# Altium schematic sheet pico-fmeter-AS65-2.SchDoc: Title
size 420 x 297 mm; Author: G.Kasprowicz; CompanyName: WUT ISE; DrawnBy: G.Kasprowicz; Organization: WUT ISE; Address1: PW ISE; Address2: Nowowiejska 15/19 00-665 Warsaw; Address3: gkasprow@gmail.com; Revision: 2; SheetNumber: -; SheetTotal: -; ModifiedBy: -; CheckedDate: -; Title2: Title 2; DivGrp: WUT ISE; Designer: G.Kasprowicz; ModifiedDate: -; ProjectName: Sensor Box
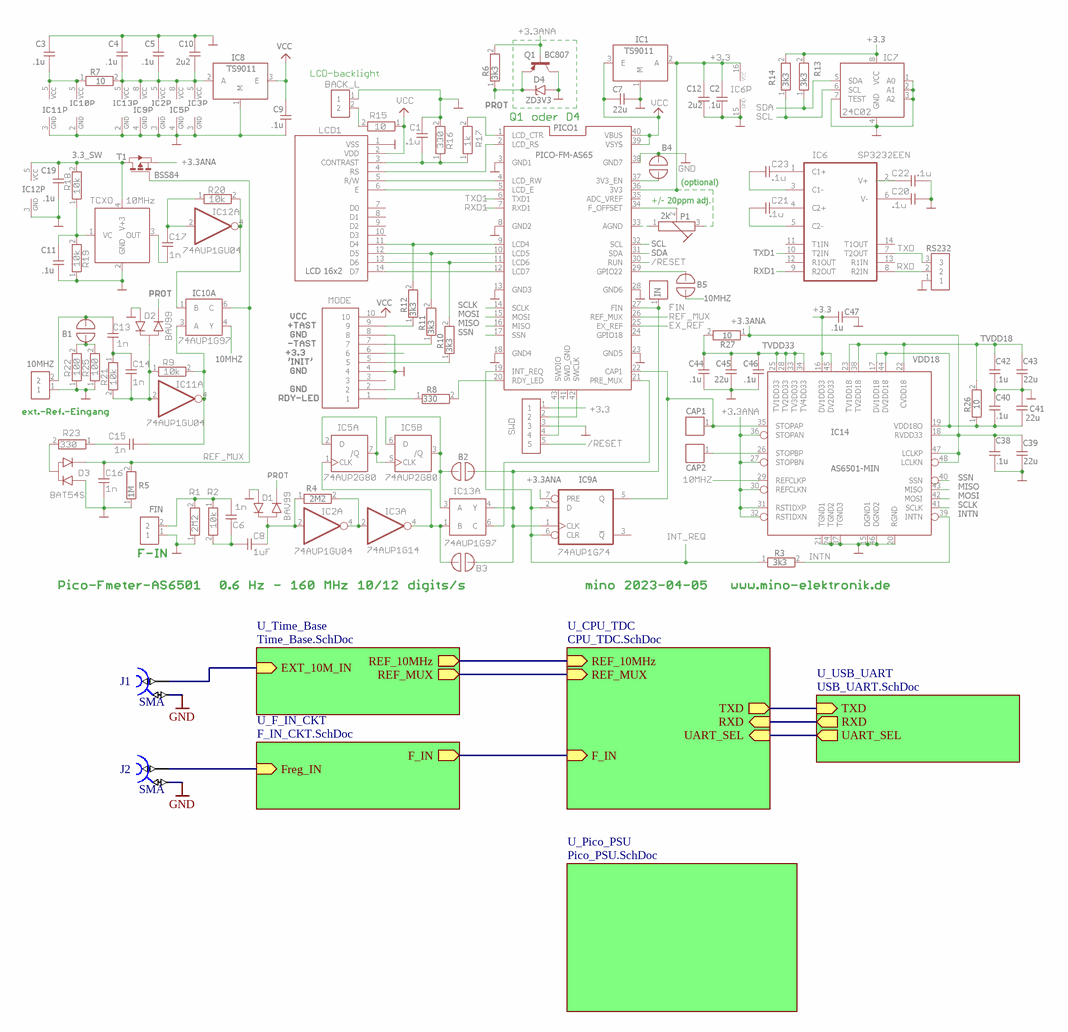
[diagram p0: pico-fmeter-AS65-2.SchDoc]

## Parts
J1  SMA  [JOHNSON_142-0701-871]
J2  SMA  [JOHNSON_142-0701-871]

## Sub-sheets
U_CPU_TDC = CPU_TDC.SchDoc: F_IN (in), REF_MUX (in), REF_10MHz (in), TXD (out), RXD (in), UART_SEL (in)
U_F_IN_CKT = F_IN_CKT.SchDoc: F_IN (out), Freg_IN (in)
U_Pico_PSU = Pico_PSU.SchDoc: no entries
U_Time_Base = Time_Base.SchDoc: REF_10MHz (out), REF_MUX (out), EXT_10M_IN (in)
U_USB_UART = USB_UART.SchDoc: RXD (out), TXD (in), UART_SEL (out)

## Nets
GND: J1.2 J2.2
NetJ1_1: J1.1 ; sheet U_Time_Base/EXT_10M_IN
NetJ2_1: J2.1 ; sheet U_F_IN_CKT/Freg_IN
(unnamed): sheet U_Time_Base/REF_10MHz, sheet U_CPU_TDC/REF_10MHz
(unnamed): sheet U_Time_Base/REF_MUX, sheet U_CPU_TDC/REF_MUX
(unnamed): sheet U_F_IN_CKT/F_IN, sheet U_CPU_TDC/F_IN
(unnamed): sheet U_CPU_TDC/TXD, sheet U_USB_UART/TXD
(unnamed): sheet U_CPU_TDC/RXD, sheet U_USB_UART/RXD
(unnamed): sheet U_CPU_TDC/UART_SEL, sheet U_USB_UART/UART_SEL

## Notes on the sheet
- Project/Equipment
- Document
- Designer
- Drawn by
- Check.by
- Copyright WUT ISE 2024.
  This documentation describes Open Hardware and is licensed under the CERN OHL v.2. You may redistribute and modify this documentation under the terms of the CERN OHL v.2. (http://ohwr.org/CERNOHL). This documentation is distributed WITHOUT ANY EXPRESS OR IMPLIED WARRANTY, INCLUDING OF MERCHANTABILITY, SATISFACTORY QUALITY AND FITNESS FOR A PARTICULAR PURPOSE. Please see the CERN OHL v.2 for applicable conditions.
- Contact
- File
- Last Mod.
- Print Date
- Sheet
- Size
- A3
- of
- Rev

## Library data of the parts
J1 J2 = JOHNSON_142-0701-871: Part Description: SMA End Launch Straight Bulkhead Jack Receptacle - Round Contact; PressFit: No; Part Number: JOHNSON_142-0701-871; Component Kind: Standard; Component Type: Standard; Pin Count: 2; Family: SMA; Mounted: Yes; Socket: No; SMD: No; Sense: No; Status: None; Manufacturer: JOHNSON; Manufacturer Part Number: 142-0701-871; ComponentHeight: 8.05mm; HelpURL: \\cern.ch\dfs\Applications\Altium\Datasheets\JOHNSON_142-0701-871.pdf; Author: CERN DEM JLC; CreateDate: 17.04.2013; LatestRevisionDate: 17.04.2013